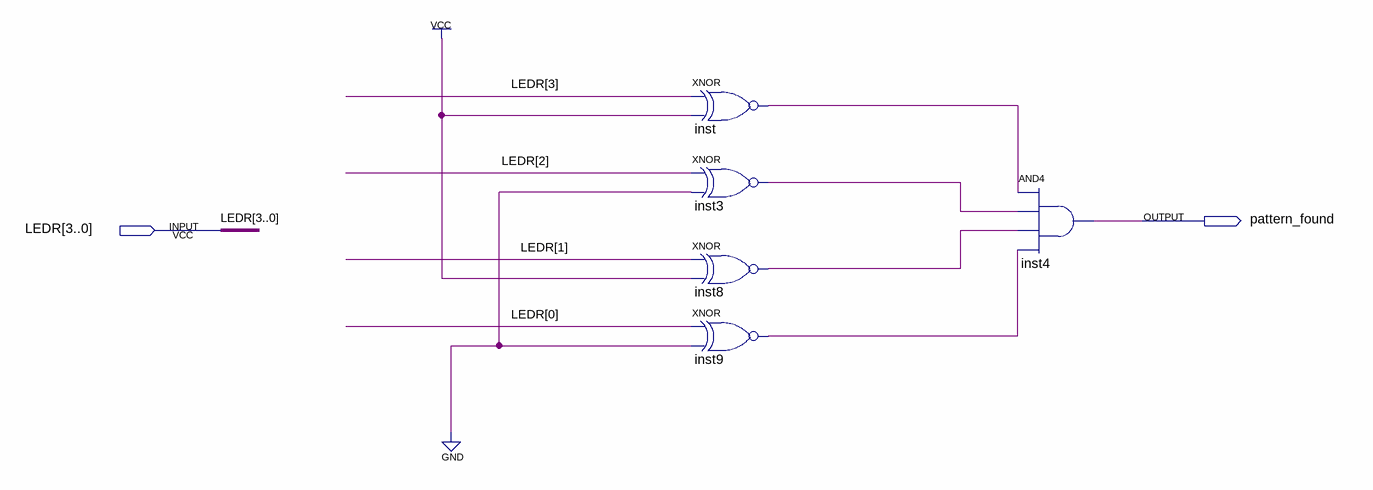
[diagram p0: schematic sheet]
// Quartus schematic Bloco_Decoder.bdf as structural Verilog: 5 symbols, 2 pins
module Bloco_Decoder (
  input  [3:0] LEDR,
  output pattern_found
);

  wire inst3_out, inst8_out, inst9_out, inst_out;

  xnor inst (inst_out, LEDR[3], 1'b1);
  xnor inst3 (inst3_out, LEDR[2], 1'b0);
  xnor inst8 (inst8_out, LEDR[1], 1'b1);
  xnor inst9 (inst9_out, LEDR[0], 1'b0);
  and inst4 (pattern_found, inst_out, inst3_out, inst8_out, inst9_out);
endmodule
